# EAGLE design board (EAGLE 7.5.0)
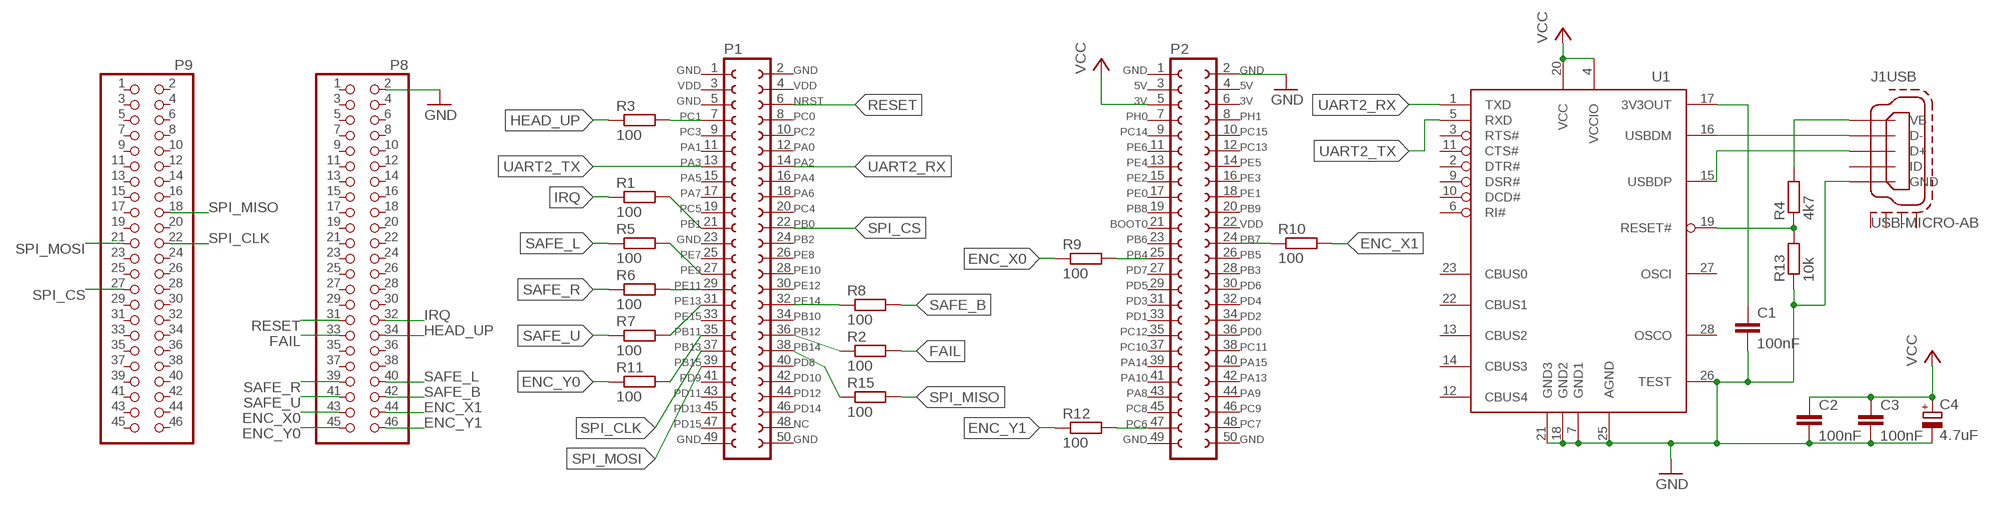
[diagram p0: schematic, sheet 1]

## Parts
C1  100nF  C-EU025-024X044  [C025-024X044]
C2  100nF  C-EU025-024X044  [C025-024X044]
C3  100nF  C-EU025-024X044  [C025-024X044]
C4  4.7uF  CPOL-EUE15-5AXIAL  [E15-5]
J1  USB-MICRO-AB  [USB-MICRO-AB]
P1  PIN-F-2X25-DISC-P1  [PIN-F-2X25]
P2  PIN-F-2X25-DISC-P2  [PIN-F-2X25]
P8  PIN-M-2X23  [PIN-M-2X23]
P9  PIN-M-2X23  [PIN-M-2X23]
R1  100  R_EU  [0204/5]
R2  100  R_EU  [0204/5]
R3  100  R_EU  [0204/5]
R4  4k7  R_EU  [0204/5]
R5  100  R_EU  [0204/5]
R6  100  R_EU  [0204/5]
R7  100  R_EU  [0204/5]
R8  100  R_EU  [0204/5]
R9  100  R_EU  [0204/5]
R10  100  R_EU  [0204/5]
R11  100  R_EU  [0204/5]
R12  100  R_EU  [0204/5]
R13  10k  R_EU  [0204/5]
R15  100  R_EU  [0204/5]
U1  FT232RL  [SSOP28DB]

## Nets
ENC_X0: P8.43 R9.1
ENC_X1: P8.44 R10.2
ENC_Y0: P8.45 R11.1
ENC_Y1: P8.46 R12.1
FAIL: P8.33 R2.2
GND: C1.2 C2.2 C3.2 C4.- J1.P$5(USB:GND) P2.2 P8.2 R13.1 U1.7(GND1) U1.18(GND2) U1.21(GND3) U1.25(AGND) U1.26(TEST)
HEAD_UP: P8.34 R3.1
IRQ: P8.32 R1.1
N$1: P1.21 R1.2
N$2: J1.P$2(USB:D-) U1.16(USBDM)
N$3: P1.38 R15.1
N$4: C1.1 U1.17(3V3OUT)
N$6: P1.36 R2.1
N$11: J1.P$3(USB:D+) U1.15(USBDP)
N$13: J1.P$1(USB:VB) R4.2
N$14: R4.1 R13.2 U1.19(RESET#)
N$19: P1.7 R3.2
N$20: P1.27 R5.2
N$21: P1.29 R6.2
N$22: P1.31 R7.2
N$23: P1.32 R8.1
N$24: P1.35 R11.2
N$25: P2.25 R9.2
N$26: P2.24 R10.1
N$27: P2.47 R12.2
RESET: P1.6 P8.31
SAFE_B: P8.42 R8.2
SAFE_L: P8.40 R5.1
SAFE_R: P8.39 R6.1
SAFE_U: P8.41 R7.1
SPI_CLK: P1.37 P9.22
SPI_CS: P1.22 P9.27
SPI_MISO: P9.18 R15.2
SPI_MOSI: P1.39 P9.21
UART2_RX: P1.14 U1.1(TXD)
UART2_TX: P1.13 U1.5(RXD)
VCC: C2.1 C3.1 C4.+ P2.5 U1.4(VCCIO) U1.20(VCC)
Unconnected: J1.P$4(USB:ID) J1.SHIELD1(SHIELD:S1) J1.SHIELD2(SHIELD:S2) J1.SHIELD3(SHIELD:S3) J1.SHIELD4(SHIELD:S4) P1.1 P1.2 P1.3 P1.4 P1.5 P1.8 P1.9 P1.10 P1.11 P1.12 P1.15 P1.16 P1.17 P1.18 P1.19 P1.20 P1.23 P1.24 P1.25 P1.26 P1.28 P1.30 P1.33 P1.34 P1.40 P1.41 P1.42 P1.43 P1.44 P1.45 P1.46 P1.47 P1.48 P1.49 P1.50 P2.1 P2.3 P2.4 P2.6 P2.7 P2.8 P2.9 P2.10 P2.11 P2.12 P2.13 P2.14 P2.15 P2.16 P2.17 P2.18 P2.19 P2.20 P2.21 P2.22 P2.23 P2.26 P2.27 P2.28 P2.29 P2.30 P2.31 P2.32 P2.33 P2.34 P2.35 P2.36 P2.37 P2.38 P2.39 P2.40 P2.41 P2.42 P2.43 P2.44 P2.45 P2.46 P2.48 P2.49 P2.50 P8.1 P8.3 P8.4 P8.5 P8.6 P8.7 P8.8 P8.9 P8.10 P8.11 P8.12 P8.13 P8.14 P8.15 P8.16 P8.17 P8.18 P8.19 P8.20 P8.21 P8.22 P8.23 P8.24 P8.25 P8.26 P8.27 P8.28 P8.29 P8.30 P8.35 P8.36 P8.37 P8.38 P9.1 P9.2 P9.3 P9.4 P9.5 P9.6 P9.7 P9.8 P9.9 P9.10 P9.11 P9.12 P9.13 P9.14 P9.15 P9.16 P9.17 P9.19 P9.20 P9.23 P9.24 P9.25 P9.26 P9.28 P9.29 P9.30 P9.31 P9.32 P9.33 P9.34 P9.35 P9.36 P9.37 P9.38 P9.39 P9.40 P9.41 P9.42 P9.43 P9.44 P9.45 P9.46 U1.2(DTR#) U1.3(RTS#) U1.6(RI#) U1.9(DSR#) U1.10(DCD#) U1.11(CTS#) U1.12(CBUS4) U1.13(CBUS2) U1.14(CBUS3) U1.22(CBUS1) U1.23(CBUS0) U1.27(OSCI) U1.28(OSCO)

## Library data of the parts
C1-C3 = resistor:C-EU: CAPACITOR, European symbol
C4 = resistor:CPOL-EU: POLARIZED CAPACITOR, European symbol
J1 = tb:USB-MICRO-AB: USB Micro-AB SMT connector Hirose Electric Co Ltd: ZX62-AB-5P
P1 = tb:PIN-F-2X25-DISC-P1: PIN HEADER; OC_FARNELL: unknown
P2 = tb:PIN-F-2X25-DISC-P2: PIN HEADER; OC_FARNELL: unknown
P8 P9 = tb:PIN-M-2X23: FEMALE HEADER
R1-R13 R15 = tb:R_EU
U1 = ftdichip-6:FT232RL: USB UART 4th Generation USB UART (USB <-> Serial) Controller

## Board
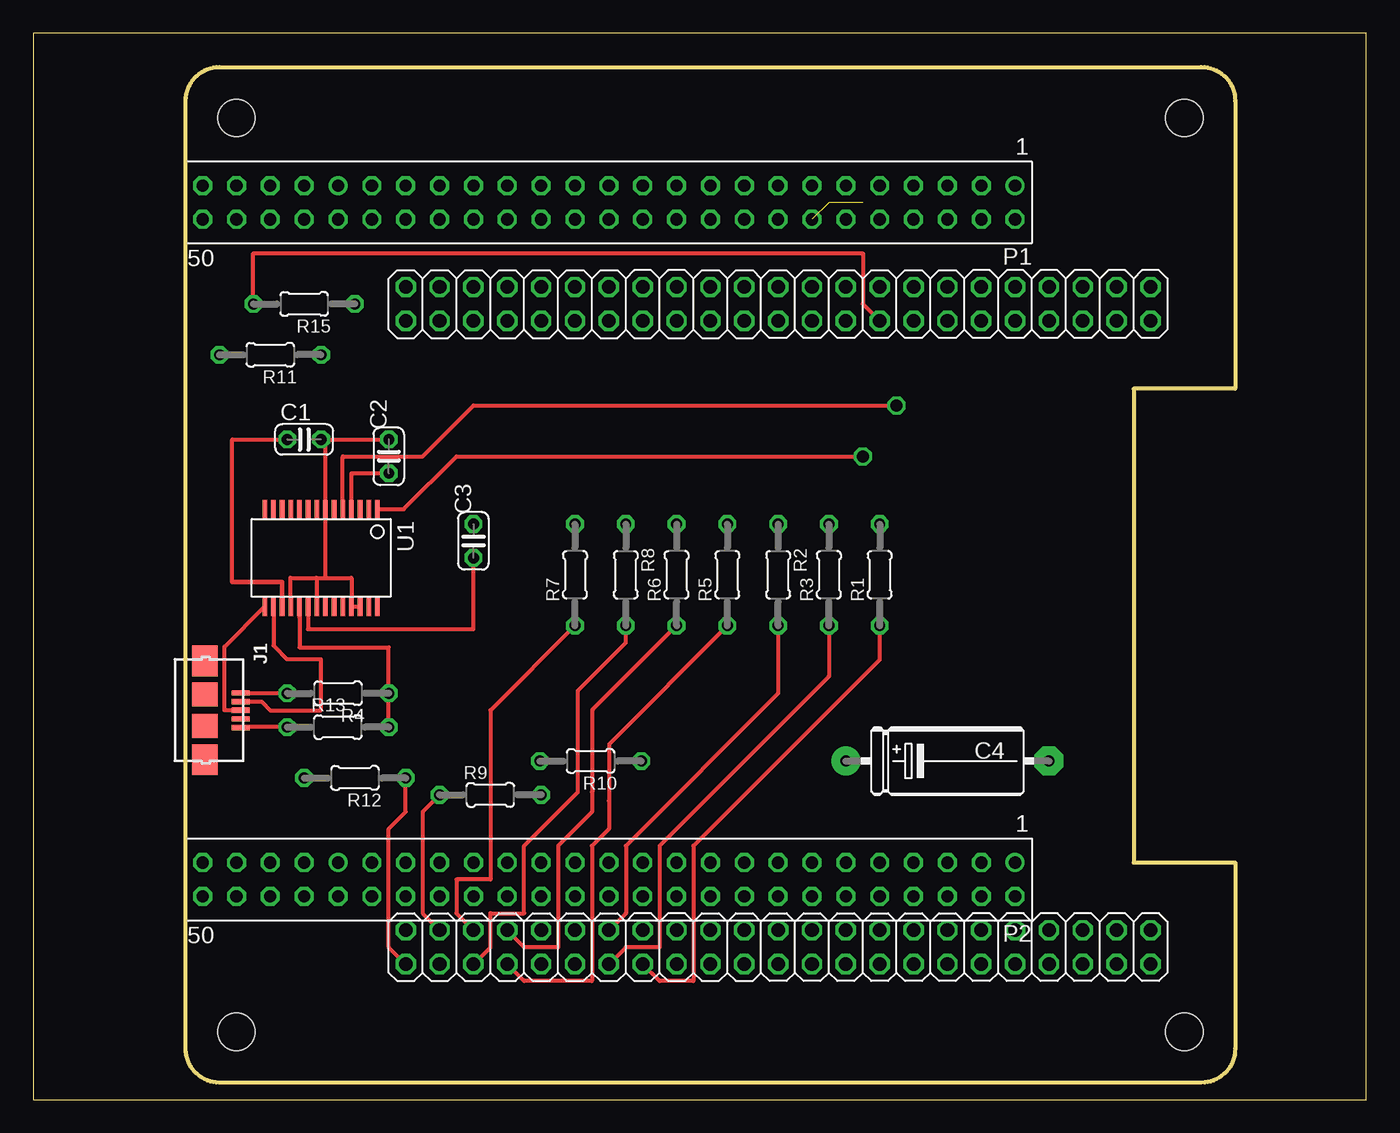
[diagram p1: board, top side]
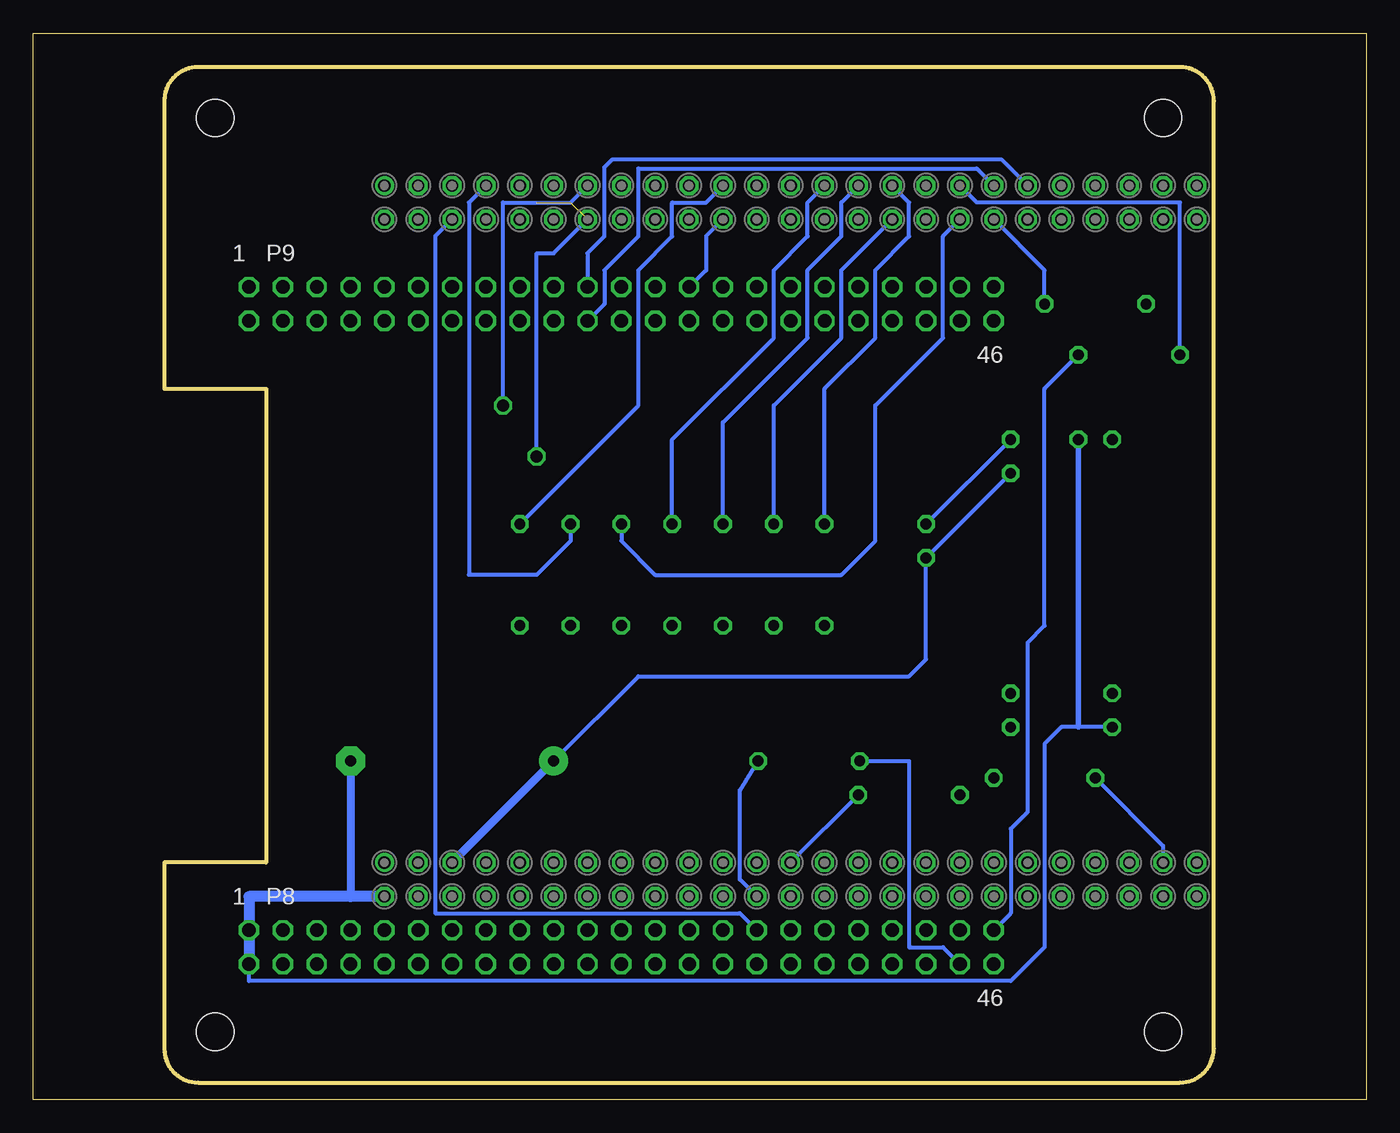
[diagram p2: board, bottom side, seen from below]

Size 100 x 80 mm. Coordinates in mm from the lower left corner, seen from the top.
Outline: 0,0 100,0 100,80 0,80 0,0
Outline: 13.97,77.47 87.63,77.47 arc-90 90.17,74.93 90.17,53.34 82.55,53.34 82.55,17.78 90.17,17.78 90.17,3.81 arc-90 87.63,1.27 13.97,1.27 arc-90 11.43,3.81 11.43,74.93 arc-90 13.97,77.47
Copper layers (1*16): Top 0.035mm / dielectric 1.5mm / Bottom 0.035mm
Design rules "default": minimum track width 10mil, minimum drill 24mil, track to track 8mil, track to pad 8mil, pad to pad 8mil, via to via 8mil, smd to smd 8mil, copper to edge 40mil, drill to drill 8mil, minimum pad ring 10mil, minimum via ring 8mil, stop-mask expansion 4mil, vias tented up to drill 0mil, thermal gap 10mil
Holes 2.8 mm at 15.24,73.66 86.36,73.66 86.36,5.08 15.24,5.08

### Footprints (pad centres in the part's own frame; a part is rotated, then mirrored left to right if it is on the bottom)
C025-024X044 = drill 0.813 octagon: 1 -1.27,0; 2 1.27,0
E15-5 = drill 0.813 pad 2.159: + -7.62,0 | drill 0.813 pad 2.159 octagon: - 7.62,0
USB-MICRO-AB = smd 0.4 x 1.35: P$1 -1.3,4.125; P$2 -0.65,4.125; P$3 0,4.125; P$4 0.65,4.125; P$5 1.3,4.125 | smd 2.301 x 1.9: SHIELD1 -3.7,1.45; SHIELD4 3.7,1.45 | smd 1.8 x 1.9: SHIELD2 -1.19,1.45; SHIELD3 1.19,1.45
PIN-F-2X25 = drill 0.914: 1 -30.48,-1.27; 41 20.32,-1.27 | drill 0.914 octagon: 2 -30.48,1.27; 3 -27.94,-1.27; 4 -27.94,1.27; 5 -25.4,-1.27; 6 -25.4,1.27; 7 -22.86,-1.27; 8 -22.86,1.27; 9 -20.32,-1.27; 10 -20.32,1.27; 11 -17.78,-1.27; 12 -17.78,1.27; 13 -15.24,-1.27; 14 -15.24,1.27; 15 -12.7,-1.27; 16 -12.7,1.27; 17 -10.16,-1.27; 18 -10.16,1.27; 19 -7.62,-1.27; 20 -7.62,1.27; 21 -5.08,-1.27; 22 -5.08,1.27; 23 -2.54,-1.27; 24 -2.54,1.27; 25 0,-1.27; 26 0,1.27; 27 2.54,-1.27; 28 2.54,1.27; 29 5.08,-1.27; 30 5.08,1.27; 31 7.62,-1.27; 32 7.62,1.27; 33 10.16,-1.27; 34 10.16,1.27; 35 12.7,-1.27; 36 12.7,1.27; 37 15.24,-1.27; 38 15.24,1.27; 39 17.78,-1.27; 40 17.78,1.27; 42 20.32,1.27; 43 22.86,-1.27; 44 22.86,1.27; 45 25.4,-1.27; 46 25.4,1.27; 47 27.94,-1.27; 48 27.94,1.27; 49 30.48,-1.27; 50 30.48,1.27
PIN-M-2X23 = drill 1.016 octagon: 1 -30.48,1.27; 2 -30.48,-1.27; 3 -27.94,1.27; 4 -27.94,-1.27; 5 -25.4,1.27; 6 -25.4,-1.27; 7 -22.86,1.27; 8 -22.86,-1.27; 9 -20.32,1.27; 10 -20.32,-1.27; 11 -17.78,1.27; 12 -17.78,-1.27; 13 -15.24,1.27; 14 -15.24,-1.27; 15 -12.7,1.27; 16 -12.7,-1.27; 17 -10.16,1.27; 18 -10.16,-1.27; 19 -7.62,1.27; 20 -7.62,-1.27; 21 -5.08,1.27; 22 -5.08,-1.27; 23 -2.54,1.27; 24 -2.54,-1.27; 25 0,1.27; 26 0,-1.27; 27 2.54,1.27; 28 2.54,-1.27; 29 5.08,1.27; 30 5.08,-1.27; 31 7.62,1.27; 32 7.62,-1.27; 33 10.16,1.27; 34 10.16,-1.27; 35 12.7,1.27; 36 12.7,-1.27; 37 15.24,1.27; 38 15.24,-1.27; 39 17.78,1.27; 40 17.78,-1.27; 41 20.32,1.27; 42 20.32,-1.27; 43 22.86,1.27; 44 22.86,-1.27; 45 25.4,1.27; 46 25.4,-1.27
0204/5 = drill 0.813 octagon: 1 -3.81,0; 2 3.81,0
SSOP28DB = smd 0.348 x 1.397: 1 -4.225,-3.656; 2 -3.575,-3.656; 3 -2.925,-3.656; 4 -2.275,-3.656; 5 -1.625,-3.656; 6 -0.975,-3.656; 7 -0.325,-3.656; 8 0.325,-3.656; 9 0.975,-3.656; 10 1.625,-3.656; 11 2.275,-3.656; 12 2.925,-3.656; 13 3.575,-3.656; 14 4.225,-3.656; 15 4.225,3.656; 16 3.575,3.656; 17 2.925,3.656; 18 2.275,3.656; 19 1.625,3.656; 20 0.975,3.656; 21 0.325,3.656; 22 -0.325,3.656; 23 -0.975,3.656; 24 -1.625,3.656; 25 -2.275,3.656; 26 -2.925,3.656; 27 -3.575,3.656; 28 -4.225,3.656

### Placement (x,y rotation side)
C1  20.32,49.53 0 top
C2  26.67,48.26 90 top
C3  33.02,41.91 90 top
C4  68.58,25.4 0 top
J1  11.43,29.21 270 top
P1  43.18,67.31 180 top
P2  43.18,16.51 180 top
P8  53.34,11.43 0 bottom
P9  53.34,59.69 0 bottom
R1  63.5,39.37 90 top
R2  55.88,39.37 270 top
R3  59.69,39.37 90 top
R4  22.86,30.48 180 top
R5  52.07,39.37 90 top
R6  48.26,39.37 90 top
R7  40.64,39.37 90 top
R8  44.45,39.37 270 top
R9  34.29,22.86 0 top
R10  41.81,25.4 180 top
R11  17.78,55.88 180 top
R12  24.13,24.13 180 top
R13  22.86,27.94 0 top
R15  20.32,59.69 180 top
U1  21.59,40.64 180 top

### Tracks (layer width: path | path; a pad name or v marks a point on that pad's centre or on a via)
ENC_X0
  Top 0.305: R9.1 29.21,21.59 29.21,13.97 P8.43
ENC_X1
  Bottom 0.305: R10.2 34.29,25.4 34.29,11.43 31.75,11.43 P8.44
ENC_Y0
  Bottom 0.305: R11.1 24.13,53.34 24.13,35.56 25.4,34.29 25.4,21.59 26.67,20.32 26.67,13.97 P8.45
ENC_Y1
  Top 0.305: R12.1 27.94,21.59 26.67,20.32 26.67,11.43 P8.46
FAIL
  Top 0.305: R2.2 55.88,30.48 44.45,19.05 44.45,13.97 P8.33
GND
  Top 0.305: 21.25,39.15 21.25,37 | C2.2 C1.2 21.91,49.2 U1.7 21.9,39.15 | U1.18 19.3,36.98 19.3,39.15 21.25,39.15 | 21.25,39.15 21.9,39.15 | 21.9,39.15 23.86,39.15 U1.25 U1.26 | R13.1 15.55,27.94 J1.P$5
  Top 0.356: 21.25,37 U1.21
  Bottom 0.305: C3.2 C2.2 | P8.2 83.82,8.89 26.67,8.89 24.13,11.43 24.13,26.67 22.86,27.94 21.59,27.94 R13.1
  Bottom 0.406: C1.2 21.59,27.94
  Bottom 0.61: C4.- 76.2,15.24
  Bottom 0.813: P2.2 76.2,15.24 83.82,15.24 P8.2
HEAD_UP
  Top 0.305: R3.1 59.69,31.75 46.99,19.05 46.99,11.43 44.45,11.43 P8.34
IRQ
  Top 0.305: R1.1 63.5,33.02 49.53,19.05 49.53,8.89 46.99,8.89 P8.32
N$1
  Bottom 0.305: P1.21 49.53,67.31 52.07,67.31 52.07,64.77 54.61,62.23 54.61,52.07 R1.2
N$2
  Top 0.305: J1.P$2 17.13,29.86 17.78,29.21 21.59,29.21 21.59,33.02 19.05,33.02 18.02,34.05 U1.16
N$3
  Bottom 0.305: R15.1 24.13,62.23 P1.38
N$4
  Top 0.305: 14.93,38.82 14.93,49.52 C1.1
  Top 0.356: U1.17 18.66,38.84 14.93,38.82
N$6
  Bottom 0.305: R2.1 55.88,41.91 53.34,39.37 39.37,39.37 36.83,41.91 36.83,52.07 31.75,57.15 31.75,64.77 P1.36
N$11
  Top 0.305: U1.15 14.35,33.97 14.35,29.21 J1.P$3
N$13
  Top 0.305: J1.P$1 19.02,30.51 R4.2
N$14
  Top 0.305: 19.96,36.15 19.97,33.92 26.67,33.92 R4.1 R13.2
  Top 0.356: U1.19 19.96,36.15
N$19
  Bottom 0.305: P1.7 67.31,67.31 67.31,39.37 62.23,39.37 59.69,41.91 R3.2
N$20
  Bottom 0.305: R5.2 52.07,49.53 44.45,57.15 44.45,62.23 41.91,64.77 41.91,67.31 P1.27
N$21
  Bottom 0.305: R6.2 48.26,50.8 41.91,57.15 41.91,62.23 39.37,64.77 39.37,67.31 P1.29
N$22
  Bottom 0.305: R7.2 40.64,53.34 36.83,57.15 36.83,62.23 34.29,64.77 34.29,67.31 P1.31
N$23
  Bottom 0.305: R8.1 44.45,52.07 39.37,57.15 39.37,62.23 P1.32
N$24
  Bottom 0.305: R11.2 13.97,67.31 29.21,67.31 P1.35
N$25
  Bottom 0.305: R9.2 P2.25
N$26
  Bottom 0.305: P2.24 46.99,16.51 46.99,23.21 R10.1
N$27
  Bottom 0.305: R12.2 15.24,19.05 P2.47
RESET
  Bottom 0.305: P1.6 69.85,64.77 69.85,13.97 46.99,13.97 P8.31
SAFE_B
  Top 0.305: R8.2 44.45,34.29 40.85,30.69 40.85,23.07 36.83,19.05 36.83,13.97 34.29,13.97 34.29,11.43 P8.42
SAFE_L
  Top 0.305: R5.1 43.23,26.67 43.23,22.46 43.18,22.41 43.18,20.32 41.91,19.05 41.91,8.89 36.83,8.89 P8.40
SAFE_R
  Top 0.305: 48.31,35.51 R6.1 41.96,29.26 41.96,23.13 41.91,23.08 41.91,21.59 39.37,19.05 39.37,11.43 36.83,11.43 P8.39
SAFE_U
  Top 0.305: R7.1 34.29,29.21 34.29,16.51 31.75,16.51 31.75,13.97 P8.41
SPI_CLK
  Bottom 0.305: P1.37 29.21,69.85 54.61,69.85 54.61,64.77 57.15,62.23 57.15,59.69 P9.22
SPI_CS
  Bottom 0.305: P1.22 49.53,64.77 49.53,62.23 P9.27
SPI_MISO
  Top 0.305: R15.2 16.51,63.5 62.23,63.5 62.23,59.69 P9.18
SPI_MOSI
  Bottom 0.305: P1.39 27.37,70.55 56.55,70.55 57.15,69.95 57.15,64.77 58.42,63.5 P9.21
UART2_RX  (via drill 0.9)  (2 unrouted)
  Top 0.305: U1.1 27.79,44.3 31.75,48.26 v62.23,48.26
  Bottom 0.305: v62.23,48.26 62.23,63.5 60.96,63.5 P1.14
UART2_TX  (via drill 0.9)
  Top 0.305: U1.5 23.21,48.26 29.21,48.26 33.02,52.07 v64.77,52.07
  Bottom 0.305: v64.77,52.07 64.77,67.31 59.69,67.31 P1.13
VCC
  Top 0.305: U1.20 20.6,35.3 33.02,35.3 C3.1 | U1.4 23.86,46.99 C2.1
  Top 0.356: U1.20
  Bottom 0.305: C2.1 C3.1 33.02,33.02 34.29,31.75 54.61,31.75 C4.+
  Bottom 0.61: P2.5 C4.+